# Altium schematic sheet RAM.SchDoc: RAM
size A3; Author: Vi Tín; SheetNumber: 7; SheetTotal: 15
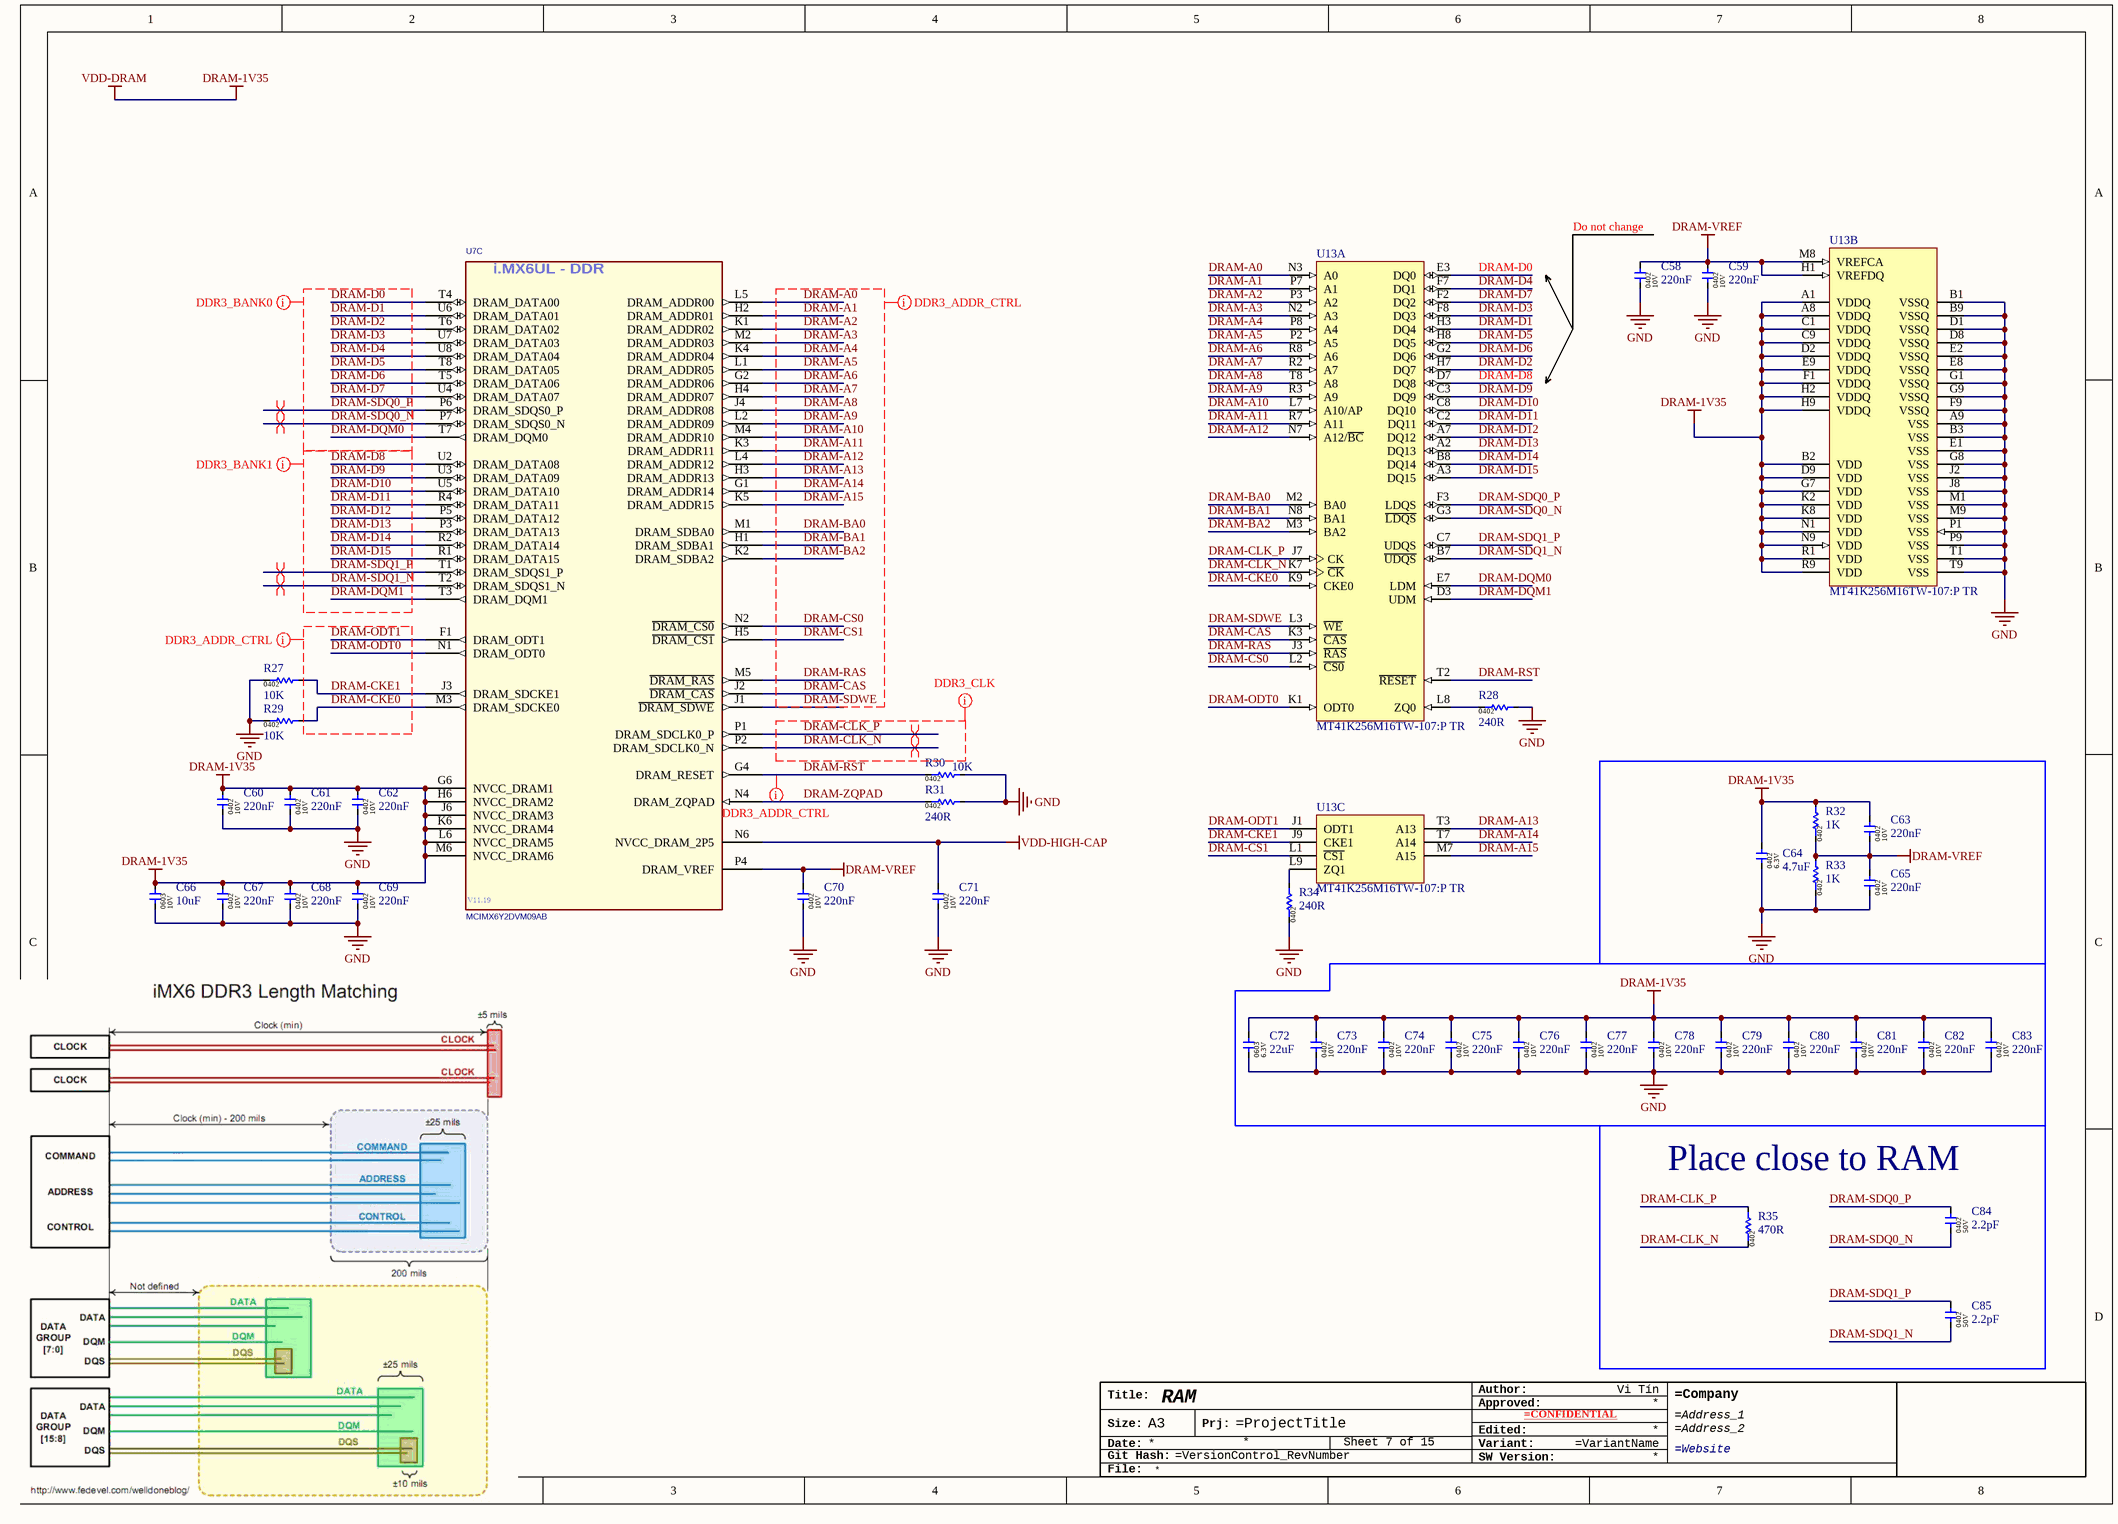
[diagram p0: RAM.SchDoc]

## Parts
*?  TitleBlock_Generic  (value not drawn)  (graphical)
C58  220nF  [CAP-0402]
C59  220nF  [CAP-0402]
C60  220nF  [CAP-0402]
C61  220nF  [CAP-0402]
C62  220nF  [CAP-0402]
C63  220nF  [CAP-0402]
C64  4.7uF  [CAP-0402]
C65  220nF  [CAP-0402]
C66  10uF  [CAP-0603]
C67  220nF  [CAP-0402]
C68  220nF  [CAP-0402]
C69  220nF  [CAP-0402]
C70  220nF  [CAP-0402]
C71  220nF  [CAP-0402]
C72  22uF  [CAP-0603]
C73  220nF  [CAP-0402]
C74  220nF  [CAP-0402]
C75  220nF  [CAP-0402]
C76  220nF  [CAP-0402]
C77  220nF  [CAP-0402]
C78  220nF  [CAP-0402]
C79  220nF  [CAP-0402]
C80  220nF  [CAP-0402]
C81  220nF  [CAP-0402]
C82  220nF  [CAP-0402]
C83  220nF  [CAP-0402]
C84  2.2pF  [CAP-0402]
C85  2.2pF  [CAP-0402]
R27  10K  [RES-0402]
R28  240R  [RES-0402]
R29  10K  [RES-0402]
R30  10K  [RES-0402]
R31  240R  [RES-0402]
R32  1K  [RES-0402]
R33  1K  [RES-0402]
R34  240R  [RES-0402]
R35  470R  [RES-0402]
U7  MCIMX6Y2DVM09AB  [IMX6ULL]  (part C of 11)
U13  MT41K256M16TW-107:P TR  [DDR3-96-8x14-PAD0.42]  (parts A,B,C of 3)

## Nets
DRAM-1V35: C60.2 C61.2 C62.2 C63.2 C64.2 C66.2 C67.2 C68.2 C69.2 C72.2 C73.2 C74.2 C75.2 C76.2 C77.2 C78.2 C79.2 C80.2 C81.2 C82.2 C83.2 R32.2 U7.G6(NVCC_DRAM1) U7.H6(NVCC_DRAM2) U7.J6(NVCC_DRAM3) U7.K6(NVCC_DRAM4) U7.L6(NVCC_DRAM5) U7.M6(NVCC_DRAM6) U13.A1(VDDQ) U13.A8(VDDQ) U13.B2(VDD) U13.C1(VDDQ) U13.C9(VDDQ) U13.D2(VDDQ) U13.D9(VDD) U13.E9(VDDQ) U13.F1(VDDQ) U13.G7(VDD) U13.H2(VDDQ) U13.H9(VDDQ) U13.K2(VDD) U13.K8(VDD) U13.N1(VDD) U13.N9(VDD) U13.R1(VDD) U13.R9(VDD)  [also labelled VDD-DRAM]
DRAM-VREF: C58.2 C59.2 C63.1 C65.2 C70.2 R32.1 R33.2 U7.P4(DRAM_VREF) U13.H1(VREFDQ) U13.M8(VREFCA)
GND: C58.1 C59.1 C60.1 C61.1 C62.1 C64.1 C65.1 C66.1 C67.1 C68.1 C69.1 C70.1 C71.1 C72.1 C73.1 C74.1 C75.1 C76.1 C77.1 C78.1 C79.1 C80.1 C81.1 C82.1 C83.1 R27.1 R28.2 R29.1 R30.2 R31.2 R33.1 R34.1 U13.A9(VSS) U13.B1(VSSQ) U13.B3(VSS) U13.B9(VSSQ) U13.D1(VSSQ) U13.D8(VSSQ) U13.E1(VSS) U13.E2(VSSQ) U13.E8(VSSQ) U13.F9(VSSQ) U13.G1(VSSQ) U13.G8(VSS) U13.G9(VSSQ) U13.J2(VSS) U13.J8(VSS) U13.M1(VSS) U13.M9(VSS) U13.P1(VSS) U13.P9(VSS) U13.T1(VSS) U13.T9(VSS)
VDD-HIGH-CAP: C71.2 U7.N6(NVCC_DRAM_2P5)
DRAM-A0: U7.L5(DRAM_ADDR00) U13.N3(A0)
DRAM-A1: U7.H2(DRAM_ADDR01) U13.P7(A1)
DRAM-A2: U7.K1(DRAM_ADDR02) U13.P3(A2)
DRAM-A3: U7.M2(DRAM_ADDR03) U13.N2(A3)
DRAM-A4: U7.K4(DRAM_ADDR04) U13.P8(A4)
DRAM-A5: U7.L1(DRAM_ADDR05) U13.P2(A5)
DRAM-A6: U7.G2(DRAM_ADDR06) U13.R8(A6)
DRAM-A7: U7.H4(DRAM_ADDR07) U13.R2(A7)
DRAM-A8: U7.J4(DRAM_ADDR08) U13.T8(A8)
DRAM-A9: U7.L2(DRAM_ADDR09) U13.R3(A9)
DRAM-A10: U7.M4(DRAM_ADDR10) U13.L7(A10/AP)
DRAM-A11: U7.K3(DRAM_ADDR11) U13.R7(A11)
DRAM-A12: U7.L4(DRAM_ADDR12) U13.N7(A12/~{BC})
DRAM-A13: U7.H3(DRAM_ADDR13) U13.T3(A13)
DRAM-A14: U7.G1(DRAM_ADDR14) U13.T7(A14)
DRAM-A15: U7.K5(DRAM_ADDR15) U13.M7(A15)
DRAM-BA0: U7.M1(DRAM_SDBA0) U13.M2(BA0)
DRAM-BA1: U7.H1(DRAM_SDBA1) U13.N8(BA1)
DRAM-BA2: U7.K2(DRAM_SDBA2) U13.M3(BA2)
DRAM-CAS: U7.J2(~{DRAM_CAS}) U13.K3(~{CAS})
DRAM-CKE0: R29.2 U7.M3(DRAM_SDCKE0) U13.K9(CKE0)
DRAM-CKE1: R27.2 U7.J3(DRAM_SDCKE1) U13.J9(CKE1)
DRAM-CLK_N: R35.1 U7.P2(DRAM_SDCLK0_N) U13.K7(~{CK})
DRAM-CLK_P: R35.2 U7.P1(DRAM_SDCLK0_P) U13.J7(CK)
DRAM-CS0: U7.N2(~{DRAM_CS0}) U13.L2(~{CS0})
DRAM-CS1: U7.H5(~{DRAM_CS1}) U13.L1(~{CS1})
DRAM-D0: U7.T4(DRAM_DATA00) U13.E3(DQ0)
DRAM-D1: U7.U6(DRAM_DATA01) U13.H3(DQ4)
DRAM-D2: U7.T6(DRAM_DATA02) U13.H7(DQ7)
DRAM-D3: U7.U7(DRAM_DATA03) U13.F8(DQ3)
DRAM-D4: U7.U8(DRAM_DATA04) U13.F7(DQ1)
DRAM-D5: U7.T8(DRAM_DATA05) U13.H8(DQ5)
DRAM-D6: U7.T5(DRAM_DATA06) U13.G2(DQ6)
DRAM-D7: U7.U4(DRAM_DATA07) U13.F2(DQ2)
DRAM-D8: U7.U2(DRAM_DATA08) U13.D7(DQ8)
DRAM-D9: U7.U3(DRAM_DATA09) U13.C3(DQ9)
DRAM-D10: U7.U5(DRAM_DATA10) U13.C8(DQ10)
DRAM-D11: U7.R4(DRAM_DATA11) U13.C2(DQ11)
DRAM-D12: U7.P5(DRAM_DATA12) U13.A7(DQ12)
DRAM-D13: U7.P3(DRAM_DATA13) U13.A2(DQ13)
DRAM-D14: U7.R2(DRAM_DATA14) U13.B8(DQ14)
DRAM-D15: U7.R1(DRAM_DATA15) U13.A3(DQ15)
DRAM-DQM0: U7.T7(DRAM_DQM0) U13.E7(LDM)
DRAM-DQM1: U7.T3(DRAM_DQM1) U13.D3(UDM)
DRAM-ODT0: U7.N1(DRAM_ODT0) U13.K1(ODT0)
DRAM-ODT1: U7.F1(DRAM_ODT1) U13.J1(ODT1)
DRAM-RAS: U7.M5(~{DRAM_RAS}) U13.J3(~{RAS})
DRAM-RST: R30.1 U7.G4(DRAM_RESET) U13.T2(~{RESET})
DRAM-SDQ0_N: C84.1 U7.P7(DRAM_SDQS0_N) U13.G3(~{LDQS})
DRAM-SDQ0_P: C84.2 U7.P6(DRAM_SDQS0_P) U13.F3(LDQS)
DRAM-SDQ1_N: C85.1 U7.T2(DRAM_SDQS1_N) U13.B7(~{UDQS})
DRAM-SDQ1_P: C85.2 U7.T1(DRAM_SDQS1_P) U13.C7(UDQS)
DRAM-SDWE: U7.J1(~{DRAM_SDWE}) U13.L3(~{WE})
DRAM-ZQPAD: R31.1 U7.N4(DRAM_ZQPAD)
NetR28_1: R28.1 U13.L8(ZQ0)
NetR34_2: R34.2 U13.L9(ZQ1)

## Layout directives
differential pair; differential pair class DIFF100_DRAM: DRAM-CLK_N, DRAM-CLK_P, DRAM-SDQ0_N, DRAM-SDQ0_P, DRAM-SDQ1_N, DRAM-SDQ1_P
net class DDR3_ADDR_CTRL: DRAM-A0, DRAM-A1, DRAM-A2, DRAM-A3, DRAM-A4, DRAM-A5, DRAM-A6, DRAM-A7, DRAM-A8, DRAM-A9, DRAM-A10, DRAM-A11, DRAM-A12, DRAM-A13, DRAM-A14, DRAM-A15, DRAM-BA0, DRAM-BA1, DRAM-BA2, DRAM-CAS, DRAM-CKE0, DRAM-CKE1, DRAM-CS0, DRAM-CS1, DRAM-ODT0, DRAM-ODT1, DRAM-RAS, DRAM-RST, DRAM-SDWE
net class DDR3_BANK0: DRAM-D0, DRAM-D1, DRAM-D2, DRAM-D3, DRAM-D4, DRAM-D5, DRAM-D6, DRAM-D7, DRAM-DQM0, DRAM-SDQ0_N, DRAM-SDQ0_P
net class DDR3_BANK1: DRAM-D8, DRAM-D9, DRAM-D10, DRAM-D11, DRAM-D12, DRAM-D13, DRAM-D14, DRAM-D15, DRAM-DQM1, DRAM-SDQ1_N, DRAM-SDQ1_P
net class DDR3_CLK: DRAM-CLK_N, DRAM-CLK_P

## Notes on the sheet
- (near C58) Do not change
- Place close to RAM
- (in symbol MCIMX6Y2DVM09AB, part C) i.MX6UL - DDR; V11.19
- (in symbol TitleBlock_Generic) Author:; Title:; Approved:; Size:; A3; Prj:; Edited:; Date:; Variant:; SW Version:; Git Hash:; File:

## Library data of the parts
C58-C63 C65 C67-C71 C73-C83 = 0402X224J100CT: 220nF ±5% 10V X5R 0402 Multilayer Ceramic Capacitors MLCC - SMD/SMT RoHS; Manufacture: WALSIN; Package / Case: 0402; Component type: Capacitor; Manufacture part: 0402X224J100CT; Capacitor value: 220nF; Voltage: 10V; Package: 0402
C64 = 0402X475M6R3CT: 4.7uF ±20% 6.3V X5R 0402 Multilayer Ceramic Capacitors MLCC - SMD/SMT RoHS; Manufacture: WALSIN; Package / Case: 0402; Component type: Capacitor; Manufacture part: 0402X475M6R3CT; Capacitor value: 4.7uF; Voltage: 6.3V; Package: 0402
C66 = 0603X106M100CT: 10uF ±20% 10V X5R 0603 Multilayer Ceramic Capacitors MLCC - SMD/SMT RoHS; Manufacture: WALSIN; Package / Case: 0402; Component type: Capacitor; Manufacture part: 0603X106M100CT; Capacitor value: 10uF; Voltage: 10V; Package: 0603
C72 = 0603X226M6R3CT: 22uF ±20% 6.3V X5R 0603 Multilayer Ceramic Capacitors MLCC - SMD/SMT RoHS; Manufacture: WALSIN; Package / Case: 0402; Component type: Capacitor; Manufacture part: 0603X226M6R3CT; Capacitor value: 22uF; Voltage: 6.3V; Package: 0603
C84 C85 = 0402N2R2B500CT: 2.2pF ±0.1pF 50V NP0 0402 Multilayer Ceramic Capacitors MLCC - SMD/SMT RoHS; Manufacture: WALSIN; Package / Case: 0402; Component type: Capacitor; Manufacture part: 0402N2R2B500CT; Capacitor value: 2.2pF; Voltage: 50V; Package: 0402
R27 R29 R30 = WR04X1002FTL: 10kΩ ±1% 1/16W ±100ppm/℃ 0402 Chip Resistor - Surface Mount RoHS; Manufacture: WALSIN; Package / Case: 0201; Component type: Resistor; Manufacture part: WR04X1002FTL; Resistor value: 10K; Package: 0402
R28 R31 R34 = WR04X2400FTL: 240Ω ±1% 1/16W ±100ppm/℃ 0402 Chip Resistor - Surface Mount RoHs; Manufacture: WALSIN; Package / Case: 0201; Component type: Resistor; Manufacture part: WR04X2400FTL; Resistor value: 240R; Package: 0402
R32 R33 = WR04X1001FTL: 1kΩ ±1% 1/16W ±100ppm/℃ 0402 Chip Resistor - Surface Mount RoHS; Manufacture: WALSIN; Package / Case: 0201; Component type: Resistor; Manufacture part: WR04X1001FTL; Resistor value: 1K; Package: 0402
R35 = WR04X4700FTL: 470Ω ±1% 1/16W ±100ppm/℃ 0402 Chip Resistor - Surface Mount RoHS; Manufacture: WALSIN; Package / Case: 0201; Component type: Resistor; Manufacture part: WR04X4700FTL; Resistor value: 470R; Package: 0402
U7 = MCIMX6Y2DVM09AB: Microprocessors - MPU i.MX 32-bit MPU ARM -A7 900MHz, 0.8mm Pitch; Manufacture: NXP Semiconductors; CLASS: IC; CAD_APPROVED: Yes; PRE_APN: 330-76997; MFG_PN01: PCIMX6G3CVM05AA; MFG_NAME01: FREESCALE SEMICONDUCTOR; AGILE_PN: TMP-WF-23753; HEIGHT: 1.37 MM; ROHS: Yes; Manufacture part: MCIMX6Y2DVM09AB; Package: MAPBGA-289 (14x14); Datasheet: https://www.mouser.vn/datasheet/2/302/IMX6ULLCEC-1126331.pdf
U13 = MT41K256M16TW-107:P TR: DRAM DDR3L 4G 256MX16 1866MT/s 14x8mm; Manufacturer: Micron; Data Bus Width: 16bit; Organisation: 64Mx16bit; Maximum Operating Supply Voltage: 1.575V; Memory Size: 1Gbit; Number of Words: 64M; Maximum Random Access Time: 1.5ns; Minimum Operating Supply Voltage: 1.425V; Address Bus Width: 17bit; Data Rate: 1333; Length: 11.5mm; Minimum Operating Temperature: 0°C; Datasheet Version: Rev. N, 11/2014; Mounting Technology: SurfaceMount; Datasheet URL: http://www.micron.com/~/media/Documents/Products/Data%20Sheet/DRAM/DDR3/1Gb_DDR3_SDRAM.pdf; Package Type: FBGA; Package Reference: JT-96; Package Description: 96-Ball Ball Grid Array, Body 14 x 8 mm, Pitch 0.8 mm; Pin Count: 96; Dimensions: 11.5x8x0.68mm; Number of Bits per Word: 16bit; Height: 0.68mm; Mounting Type: SurfaceMount; Maximum Operating Temperature: +95°C; Manufacturer URL: http://www.micron.com/; Width: 8mm; Manufacture part: MT41K256M16TW-107:P TR; Manufacture: Micron; Package: FBGA-96; Datasheet: https://www.mouser.vn/datasheet/2/671/4Gb_DDR3L-1283964.pdf
*? = TitleBlock_Generic: Manufacture part: TitleBlock_Generic; Manufacture: N/A; Type: Graphic